# EAGLE design piHatJoystick (EAGLE 9.5.1)
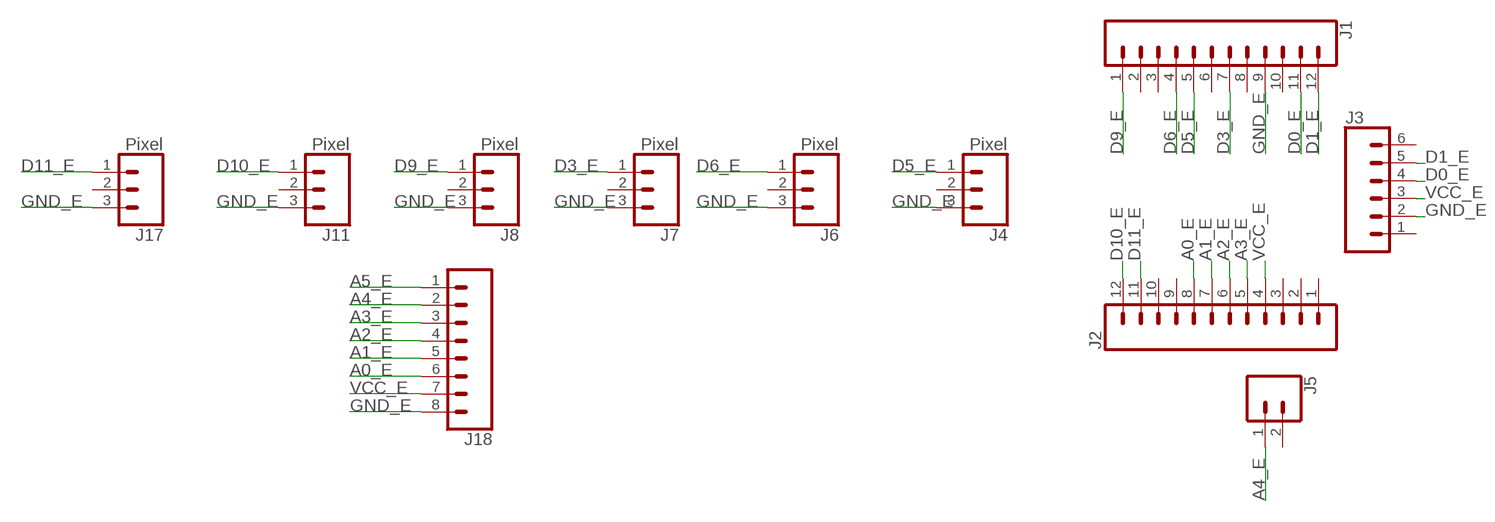
[diagram p0: schematic, sheet 1]

## Parts
J1  CONN_12  [1X12]
J2  CONN_12  [1X12]
J3  CONN_06SILK_FEMALE_PTH  [1X06]
J4  Pixel  CONN_03  [1X03]
J5  CONN_02  [1X02]
J6  Pixel  CONN_03  [1X03]
J7  Pixel  CONN_03  [1X03]
J8  Pixel  CONN_03  [1X03]
J11  Pixel  CONN_03  [1X03]
J17  Pixel  CONN_03  [1X03]
J18  CONN_08"  [1X08]

## Nets
A0_E: J2.8 J18.6
A1_E: J2.7 J18.5
A2_E: J2.6 J18.4
A3_E: J2.5 J18.3
A4_E: J5.1 J18.2
A5_E: J18.1
D0_E: J1.11 J3.4
D1_E: J1.12 J3.5
D3_E: J1.7 J7.1
D5_E: J1.5 J4.1
D6_E: J1.4 J6.1
D9_E: J1.1 J8.1
D10_E: J2.12 J11.1
D11_E: J2.11 J17.1
GND_E: J1.9 J3.2 J4.3 J6.3 J7.3 J8.3 J11.3 J17.3 J18.8
VCC_E: J2.4 J3.3 J18.7
Unconnected: J1.2 J1.3 J1.6 J1.8 J1.10 J2.1 J2.2 J2.3 J2.9 J2.10 J3.1 J3.6 J4.2 J5.2 J6.2 J7.2 J8.2 J11.2 J17.2

## Library data of the parts
J1 J2 = SparkFun-Connectors:CONN_12: Multi connection point. Often used as Generic Header-pin footprint for 0.1 inch spaced/style header connections On any of the 0.1 inch spaced packages, you can populate with these: Break Away Headers - Straight <https://www.sparkfun.com/products/116> (PRT-00116) Break Away Male Headers - Right Angle <https://www.sparkfun.com/products/553> (PRT-00553) Female Headers <https://www.sparkfun.com/products/115> (PRT-00115) Break Away Headers - Machine Pin <https://www.sparkfun.com/products/117> (PRT-00117) Break Away Female Headers - Swiss Machine Pin <https://www.sparkfun.com/products/743> (PRT-00743) For SCREWTERMINALS and SPRING TERMINALS visit here: Screw Terimnals on SparkFun.com <https://www.sparkfun.com/search/results?term=Screw+Terminals> (5mm/3.5mm/2.54mm spacing) This device is also useful as a general connection point to wire up your design to another part of your project. Our various solder wires solder well into these plated through hole pads. Hook-Up Wire - Assortment (Stranded, 22 AWG) <https://www.sparkfun.com/products/11375> (PRT-11375) Hook-Up Wire - Assortment (Solid Core, 22 AWG) <https://www.sparkfun.com/products/11367> (PRT-11367) View the entire wire category on our website here <https://www.sparkfun.com/categories/141> Special notes: Molex polarized connector foot print use with SKU : PRT-08231 with associated crimp pins and housings. 1MM SMD Version SKU: PRT-10208 NOTES ON THE VARIANTS LOCK and LOCK_LONGPADS... This footprint was designed to help hold the alignment of a through-hole component (i.e. 6-pin header) while soldering it into place. You may notice that each hole has been shifted either up or down by 0.005 of an inch from it's more standard position (which is a perfectly straight line). This slight alteration caused the pins (the squares in the middle) to touch the edges of the holes. Because they are alternating, it causes a "brace" to hold the component in place. 0.005 has proven to be the perfect amount of "off-center" position when using our standard breakaway headers. Although looks a little odd when you look at the bare footprint, once you have a header in there, the alteration is very hard to notice. Also,if you push a header all the way into place, it is covered up entirely on the bottom side.
J3 = SparkFun-Connectors:CONN_06: Multi connection point. Often used as Generic Header-pin footprint for 0.1 inch spaced/style header connections On any of the 0.1 inch spaced packages, you can populate with these: Break Away Headers - Straight <https://www.sparkfun.com/products/116> (PRT-00116) Break Away Male Headers - Right Angle <https://www.sparkfun.com/products/553> (PRT-00553) Female Headers <https://www.sparkfun.com/products/115> (PRT-00115) Break Away Headers - Machine Pin <https://www.sparkfun.com/products/117> (PRT-00117) Break Away Female Headers - Swiss Machine Pin <https://www.sparkfun.com/products/743> (PRT-00743) Arduino Stackable Header - 6 Pin <https://www.sparkfun.com/products/9280> (PRT-09280) For SCREWTERMINALS and SPRING TERMINALS visit here: Screw Terimnals on SparkFun.com <https://www.sparkfun.com/search/results?term=Screw+Terminals> (5mm/3.5mm/2.54mm spacing) This device is also useful as a general connection point to wire up your design to another part of your project. Our various solder wires solder well into these plated through hole pads. Hook-Up Wire - Assortment (Stranded, 22 AWG) <https://www.sparkfun.com/products/11375> (PRT-11375) Hook-Up Wire - Assortment (Solid Core, 22 AWG) <https://www.sparkfun.com/products/11367> (PRT-11367) View the entire wire category on our website here <https://www.sparkfun.com/categories/141>; PROD_ID: CONN-08437
J4 J6-J8 J11 J17 = SparkFun-Connectors:CONN_03: Multi connection point. Often used as Generic Header-pin footprint for 0.1 inch spaced/style header connections On any of the 0.1 inch spaced packages, you can populate with these: Break Away Headers - Straight <https://www.sparkfun.com/products/116> (PRT-00116) Break Away Male Headers - Right Angle <https://www.sparkfun.com/products/553> (PRT-00553) Female Headers <https://www.sparkfun.com/products/115> (PRT-00115) Break Away Headers - Machine Pin <https://www.sparkfun.com/products/117> (PRT-00117) Break Away Female Headers - Swiss Machine Pin <https://www.sparkfun.com/products/743> (PRT-00743) Stackable Header - 3 Pin (Female, 0.1") <https://www.sparkfun.com/products/13875> (PRT-13875) For SCREWTERMINALS and SPRING TERMINALS visit here: Screw Terimnals on SparkFun.com <https://www.sparkfun.com/search/results?term=Screw+Terminals> (5mm/3.5mm/2.54mm spacing) This device is also useful as a general connection point to wire up your design to another part of your project. Our various solder wires solder well into these plated through hole pads. Hook-Up Wire - Assortment (Stranded, 22 AWG) <https://www.sparkfun.com/products/11375> (PRT-11375) Hook-Up Wire - Assortment (Solid Core, 22 AWG) <https://www.sparkfun.com/products/11367> (PRT-11367) View the entire wire category on our website here <https://www.sparkfun.com/categories/141> Special notes: Molex polarized connector foot print use with SKU : PRT-08232 with associated crimp pins and housings.; PROD_ID: XXX-00000; VALUE: 455-1750-1-ND
J5 = SparkFun-Connectors:CONN_02: Multi connection point. Often used as Generic Header-pin footprint for 0.1 inch spaced/style header connections On any of the 0.1 inch spaced packages, you can populate with these: Break Away Headers - Straight <https://www.sparkfun.com/products/116> (PRT-00116) Break Away Male Headers - Right Angle <https://www.sparkfun.com/products/553> (PRT-00553) Female Headers <https://www.sparkfun.com/products/115> (PRT-00115) Break Away Headers - Machine Pin <https://www.sparkfun.com/products/117> (PRT-00117) Break Away Female Headers - Swiss Machine Pin <https://www.sparkfun.com/products/743> (PRT-00743) For SCREWTERMINALS and SPRING TERMINALS visit here: Screw Terimnals on SparkFun.com <https://www.sparkfun.com/search/results?term=Screw+Terminals> (5mm/3.5mm/2.54mm spacing) This device is also useful as a general connection point to wire up your design to another part of your project. Our various solder wires solder well into these plated through hole pads. Hook-Up Wire - Assortment (Stranded, 22 AWG) <https://www.sparkfun.com/products/11375> (PRT-11375) Hook-Up Wire - Assortment (Solid Core, 22 AWG) <https://www.sparkfun.com/products/11367> (PRT-11367) View the entire wire category on our website here <https://www.sparkfun.com/categories/141> Special notes: Molex polarized connector foot print use with: PRT-08233 with associated crimp pins and housings. 2.54_SCREWTERM for use with PRT-10571. 3.5mm Screw Terminal footprints for PRT-08084 5mm Screw Terminal footprints for use with PRT-08432
J18 = SparkFun-Connectors:CONN_08: Multi connection point. Often used as Generic Header-pin footprint for 0.1 inch spaced/style header connections On any of the 0.1 inch spaced packages, you can populate with these: Break Away Headers - Straight <https://www.sparkfun.com/products/116> (PRT-00116) Break Away Male Headers - Right Angle <https://www.sparkfun.com/products/553> (PRT-00553) Female Headers <https://www.sparkfun.com/products/115> (PRT-00115) Break Away Headers - Machine Pin <https://www.sparkfun.com/products/117> (PRT-00117) Break Away Female Headers - Swiss Machine Pin <https://www.sparkfun.com/products/743> (PRT-00743) Arduino Stackable Header - 8 Pin <https://www.sparkfun.com/products/9279> (PRT-09279) For SCREWTERMINALS and SPRING TERMINALS visit here: Screw Terimnals on SparkFun.com <https://www.sparkfun.com/search/results?term=Screw+Terminals> (5mm/3.5mm/2.54mm spacing) This device is also useful as a general connection point to wire up your design to another part of your project. Our various solder wires solder well into these plated through hole pads. Hook-Up Wire - Assortment (Stranded, 22 AWG) <https://www.sparkfun.com/products/11375> (PRT-11375) Hook-Up Wire - Assortment (Solid Core, 22 AWG) <https://www.sparkfun.com/products/11367> (PRT-11367) View the entire wire category on our website here <https://www.sparkfun.com/categories/141> Special notes: Molex polarized connector foot print use with SKU : PRT-08231 with associated crimp pins and housings. 1MM SMD Version SKU: PRT-10208 NOTES ON THE VARIANTS LOCK and LOCK_LONGPADS... This footprint was designed to help hold the alignment of a through-hole component (i.e. 6-pin header) while soldering it into place. You may notice that each hole has been shifted either up or down by 0.005 of an inch from it's more standard position (which is a perfectly straight line). This slight alteration caused the pins (the squares in the middle) to touch the edges of the holes. Because they are alternating, it causes a "brace" to hold the component in place. 0.005 has proven to be the perfect amount of "off-center" position when using our standard breakaway headers. Although looks a little odd when you look at the bare footprint, once you have a header in there, the alteration is very hard to notice. Also,if you push a header all the way into place, it is covered up entirely on the bottom side.; PROD_ID: CONN-08438

## Net classes
0 default: width 0.254 mm, clearance 0.254 mm
1 power: width 0.61 mm, drill 0.711 mm, clearance 0.33 mm
2 gnd: width 0.305 mm, drill 0.711 mm, clearance 0.254 mm
3 usbvcc: width 0.508 mm, drill 0.711 mm, clearance 0.254 mm
4 aref: width 0.406 mm

## Board
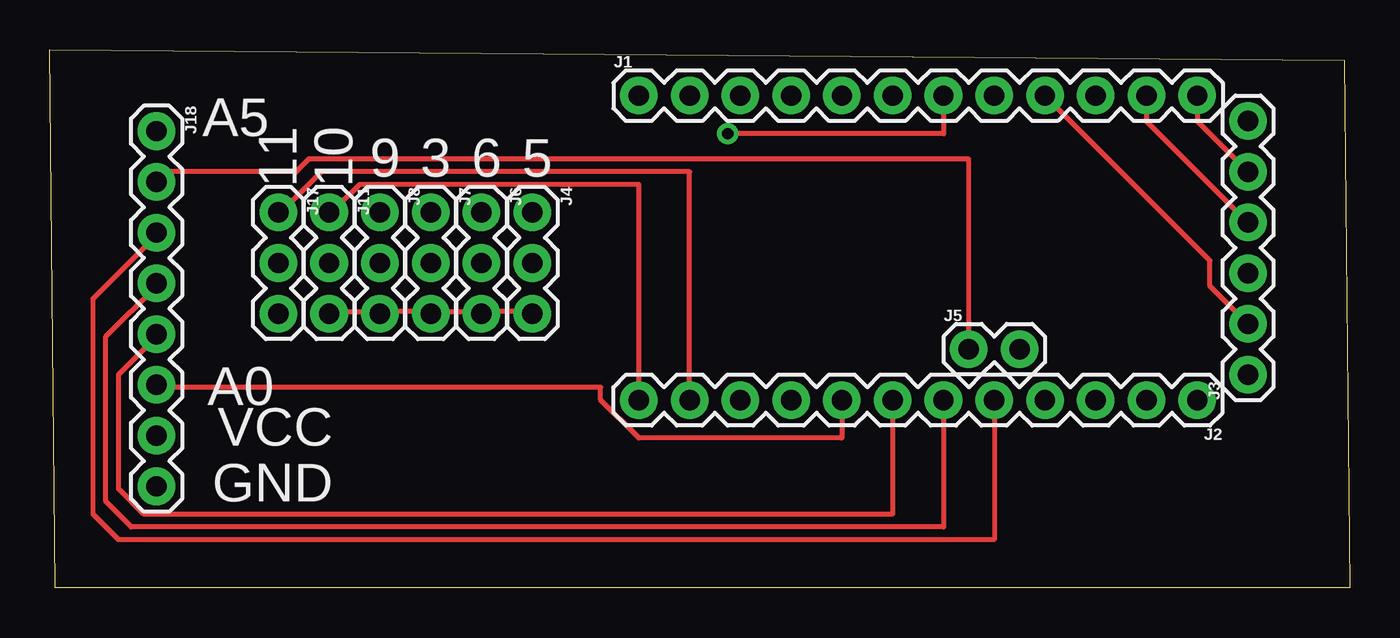
[diagram p1: board, top side]
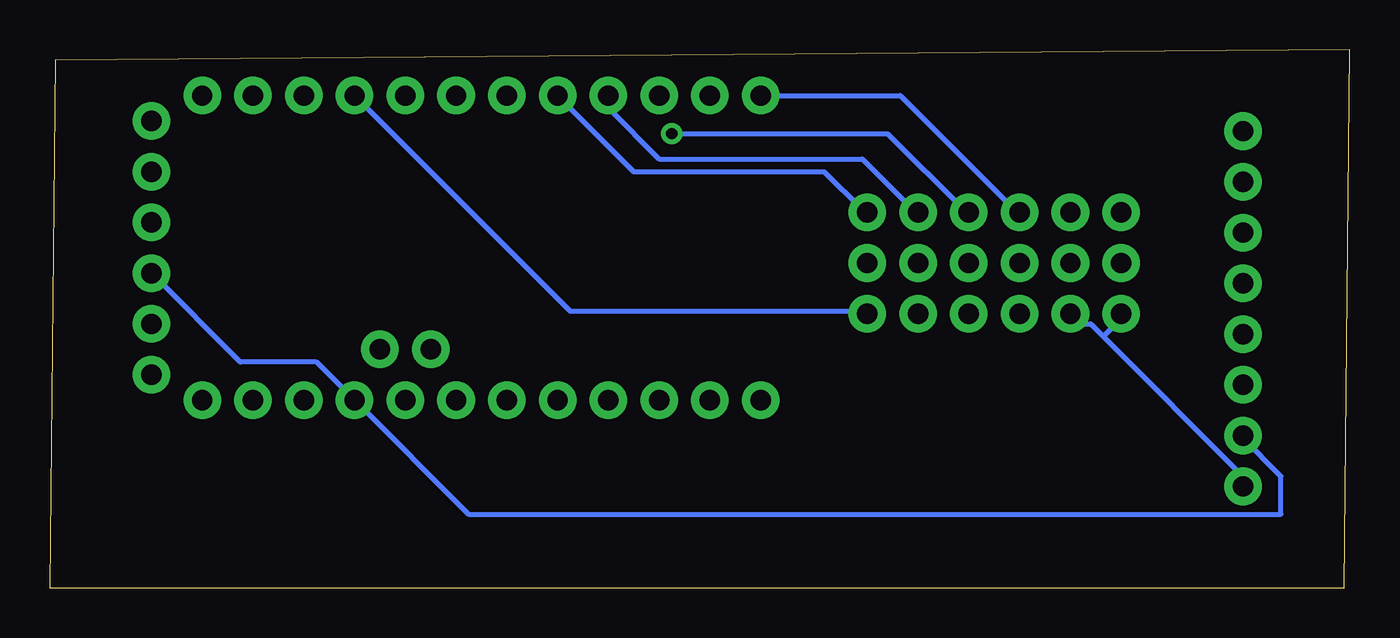
[diagram p2: board, bottom side, seen from below]

Size 65.02 x 26.92 mm. Coordinates in mm from the lower left corner, seen from the top.
Outline: 0,26.92 64.77,26.42 65.02,0 0.25,0 0,26.92
Copper layers (1*16): Top 0.035mm / dielectric 1.5mm / Bottom 0.035mm
Design rules "default": minimum track width 10mil, minimum drill 22mil, track to track 10mil, track to pad 10mil, pad to pad 10mil, via to via 16mil, smd to smd 8mil, copper to edge 30mil, drill to drill 12mil, minimum pad ring 10mil, minimum via ring 10mil, stop-mask expansion 4mil, vias tented up to drill 0mil, thermal gap 10mil
vRestrict: area 16.8,-11.2 to 18.4,-7.5; area 24.8,-15.6 to 26.3,-12.1; area 27.3,-15.6 to 28.8,-12.1; area 29.8,-15.6 to 31.4,-12.1; area 33.9,-18 to 34.4,-17.8

### Footprints (pad centres in the part's own frame; a part is rotated, then mirrored left to right if it is on the bottom)
1X12 = drill 1.016 pad 1.88: 1 0,0; 2 2.54,0; 3 5.08,0; 4 7.62,0; 5 10.16,0; 6 12.7,0; 7 15.24,0; 8 17.78,0; 9 20.32,0; 10 22.86,0; 11 25.4,0; 12 27.94,0
1X06 = drill 1.016 pad 1.88: 1 0,0; 2 2.54,0; 3 5.08,0; 4 7.62,0; 5 10.16,0; 6 12.7,0
1X03 = drill 1.016 pad 1.88: 1 0,0; 2 2.54,0; 3 5.08,0
1X02 = drill 1.016 pad 1.88: 1 0,0; 2 2.54,0
1X08 = drill 1.016 pad 1.88: 1 0,0; 2 2.54,0; 3 5.08,0; 4 7.62,0; 5 10.16,0; 6 12.7,0; 7 15.24,0; 8 17.78,0

### Placement (x,y rotation side)
J1  29.46,24.64 0 top
J2  57.4,9.4 180 top
J3  59.94,10.67 90 top
J4  24.13,18.8 270 top
J5  45.97,11.94 0 top
J6  21.59,18.8 270 top
J7  19.05,18.8 270 top
J8  16.51,18.8 270 top
J11  13.97,18.8 270 top
J17  11.43,18.8 270 top
J18  5.33,22.86 270 top

### Tracks (layer width: path | path; a pad name or v marks a point on that pad's centre or on a via)
A0_E
  Top 0.254: J2.8 39.62,7.49 29.46,7.49 27.56,9.4 27.56,10.03 5.33,10.03 J18.6
A1_E
  Top 0.254: J2.7 42.16,3.68 4.7,3.68 3.43,4.95 3.43,10.67 5.33,12.57 J18.5
A2_E
  Top 0.254: J2.6 44.7,3.05 4.06,3.05 2.79,4.32 2.79,12.57 5.33,15.11 J18.4
A3_E
  Top 0.254: J2.5 47.24,2.41 3.43,2.41 2.16,3.68 2.16,14.48 5.33,17.65 J18.3
A4_E
  Top 0.254: J5.1 45.97,21.46 12.95,21.46 12.32,20.83 5.33,20.83 J18.2
D0_E
  Top 0.254: J3.4 54.86,23.37 J1.11
D1_E
  Top 0.254: J3.5 57.4,23.37 J1.12
D3_E  (via drill 0.56)
  Top 0.254: v33.91,22.73 44.7,22.73 J1.7
  Bottom 0.254: v33.91,22.73 23.11,22.73 19.3,18.92 J7.1
D5_E
  Bottom 0.254: J1.5 35.81,20.83 26.29,20.83 24.38,18.92 J4.1
D6_E
  Bottom 0.254: J1.4 37.08,24 34.54,21.46 24.38,21.46 21.84,18.92 J6.1
D9_E
  Bottom 0.254: J1.1 22.48,24.64 16.76,18.92 J8.1
D10_E
  Top 0.254: J2.12 29.46,20.19 15.49,20.19 14.22,18.92 J11.1
D11_E
  Top 0.254: J2.11 32,20.83 13.59,20.83 11.68,18.92 J17.1
GND_E
  Top 0.254: J1.9 58.04,16.38 58.04,15.11 J3.2 | J4.3 23.75,13.84 21.84,13.84 J6.3 21.21,13.84 19.3,13.84 J7.3 18.67,13.84 16.76,13.84 J8.3 16.13,13.84 14.22,13.84 J11.3
  Bottom 0.254: 12.32,12.57 12.95,13.21 13.59,13.21 J11.3 | 12.32,12.57 5.33,5.59 J18.8 | 12.32,12.57 11.68,13.21 J17.3 | J1.9 38.99,13.84 24.38,13.84 J4.3
VCC_E
  Bottom 0.254: J18.7 5.33,7.49 3.43,5.59 3.43,3.68 44.07,3.68 J2.4 51.69,11.3 55.5,11.3 J3.3

### Text on the board
tNames: 3 2 1 0 9 8 | GND | 1 1 1 1 | AREF | PWM | PWM | PWM | USB
Reference: C8 | C2 | R11 | C4 | C5
_tsilk: 11 | 10 | A5 | 9 | 3 | 6 | 5 | A0 | VCC | GND